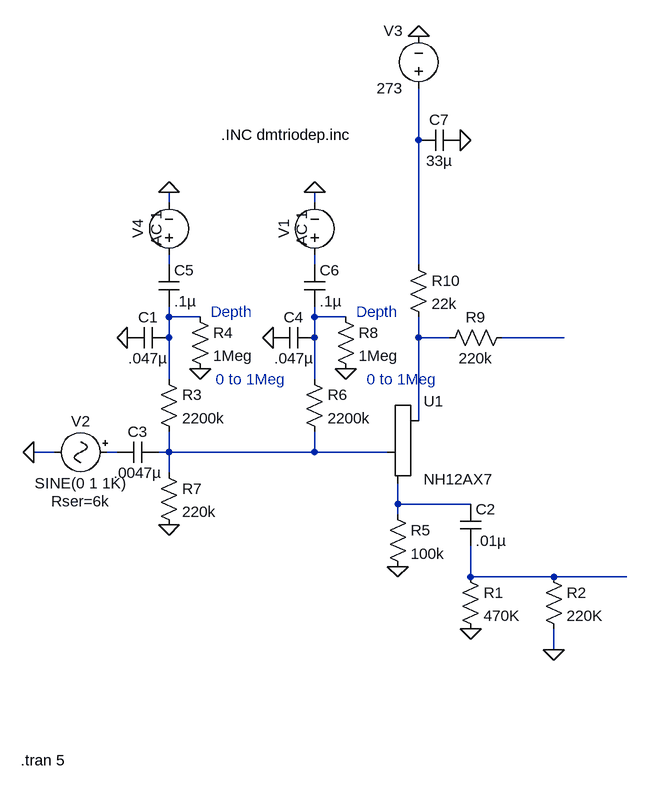
[diagram p0: schematic Simplified Dual Tremolo.asc]
Simplified Dual Tremolo.asc, the LTspice schematic file:
Version 4
SHEET 1 880 680
WIRE -16 -448 -16 -528
WIRE -400 -352 -400 -368
WIRE -176 -352 -176 -368
WIRE -400 -256 -400 -272
WIRE -176 -256 -176 -272
WIRE -16 -256 -16 -448
WIRE -400 -176 -400 -192
WIRE -352 -176 -400 -176
WIRE -176 -176 -176 -192
WIRE -128 -176 -176 -176
WIRE -400 -144 -400 -176
WIRE -176 -144 -176 -176
WIRE -16 -144 -16 -176
WIRE 32 -144 -16 -144
WIRE 208 -144 112 -144
WIRE -400 -80 -400 -144
WIRE -176 -80 -176 -144
WIRE -16 -16 -16 -144
WIRE -576 32 -608 32
WIRE -480 32 -496 32
WIRE -400 32 -400 0
WIRE -400 32 -416 32
WIRE -176 32 -176 0
WIRE -176 32 -400 32
WIRE -64 32 -176 32
WIRE -400 64 -400 32
WIRE -48 112 -48 80
WIRE 64 112 -48 112
WIRE -48 128 -48 112
WIRE 64 224 64 176
WIRE 192 224 64 224
WIRE 304 224 192 224
WIRE 192 336 192 304
FLAG -48 208 0
FLAG 64 304 0
FLAG 192 336 0
FLAG -400 144 0
FLAG -240 -144 0
FLAG -128 -96 0
FLAG -608 32 0
FLAG -16 -608 0
FLAG 48 -448 0
FLAG -176 -368 0
FLAG -464 -144 0
FLAG -352 -96 0
FLAG -400 -368 0
SYMBOL res 48 208 R0
SYMATTR InstName R1
SYMATTR Value 470K
SYMBOL res 176 208 R0
SYMATTR InstName R2
SYMATTR Value 220K
SYMBOL Misc\\triode -16 32 R0
SYMATTR InstName U1
SYMATTR Value NH12AX7
SYMBOL cap 48 112 R0
SYMATTR InstName C2
SYMATTR Value .01µ
SYMBOL res -64 112 R0
SYMATTR InstName R5
SYMATTR Value 100k
SYMBOL cap -416 16 R90
WINDOW 0 0 32 VBottom 0
WINDOW 3 32 32 VTop 0
SYMATTR InstName C3
SYMATTR Value .0047µ
SYMBOL res -192 -96 R0
SYMATTR InstName R6
SYMATTR Value 2200k
SYMBOL res -416 48 R0
SYMATTR InstName R7
SYMATTR Value 220k
SYMBOL cap -176 -160 R90
WINDOW 0 0 32 VBottom 0
WINDOW 3 32 32 VTop 0
SYMATTR InstName C4
SYMATTR Value .047µ
SYMBOL res -144 -192 R0
SYMATTR InstName R8
SYMATTR Value 1Meg
SYMBOL Misc\\signal -480 32 R90
WINDOW 0 -32 56 VBottom 0
WINDOW 3 32 56 VTop 0
WINDOW 123 60 56 VTop 0
WINDOW 39 60 56 VTop 0
SYMATTR InstName V2
SYMATTR SpiceLine Rser=6k
SYMBOL voltage -16 -512 R180
WINDOW 0 24 104 Left 0
WINDOW 3 24 16 Left 0
WINDOW 123 0 0 Left 0
WINDOW 39 0 0 Left 0
SYMATTR InstName V3
SYMATTR Value 273
SYMBOL res 128 -160 R90
WINDOW 0 0 56 VBottom 0
WINDOW 3 32 56 VTop 0
SYMATTR InstName R9
SYMATTR Value 220k
SYMBOL cap -192 -256 R0
SYMATTR InstName C6
SYMATTR Value .1µ
SYMBOL res -32 -272 R0
SYMATTR InstName R10
SYMATTR Value 22k
SYMBOL cap 48 -464 R90
WINDOW 0 0 32 VBottom 0
WINDOW 3 32 32 VTop 0
SYMATTR InstName C7
SYMATTR Value 33µ
SYMBOL voltage -176 -256 R180
WINDOW 0 32 56 VTop 0
WINDOW 3 -32 56 Invisible 0
WINDOW 123 4 56 VTop 0
WINDOW 39 0 0 Left 0
SYMATTR InstName V1
SYMATTR Value SINE(137 115 1.33)
SYMATTR Value2 AC 1
SYMBOL res -416 -96 R0
SYMATTR InstName R3
SYMATTR Value 2200k
SYMBOL cap -400 -160 R90
WINDOW 0 0 32 VBottom 0
WINDOW 3 32 32 VTop 0
SYMATTR InstName C1
SYMATTR Value .047µ
SYMBOL res -368 -192 R0
SYMATTR InstName R4
SYMATTR Value 1Meg
SYMBOL cap -416 -256 R0
SYMATTR InstName C5
SYMATTR Value .1µ
SYMBOL voltage -400 -256 R180
WINDOW 0 32 56 VTop 0
WINDOW 3 -32 56 Invisible 0
WINDOW 123 4 56 VTop 0
WINDOW 39 0 0 Left 0
SYMATTR InstName V4
SYMATTR Value SINE(137 115 1)
SYMATTR Value2 AC 1
TEXT -112 -184 Left 0 ;Depth
TEXT -96 -80 Left 0 ;0 to 1Meg
TEXT -320 -456 Left 0 !.INC dmtriodep.inc
TEXT -336 -184 Left 0 ;Depth
TEXT -328 -80 Left 0 ;0 to 1Meg
TEXT -628 506 Left 0 !.tran 5

The netlist it stands for:
* Simplified Dual Tremolo.asc
R1 N011 0 470K
R2 N011 0 220K
XU1 N006 N009 N010 NH12AX7
C2 N010 N011 .01µ
R5 N010 0 100k
C3 N009 N008 .0047µ
R6 N005 N009 2200k
R7 N009 0 220k
C4 N005 0 .047µ
R8 N005 0 1Meg
V2 N008 0 SINE(0 1 1K) Rser=6k
V3 N001 0 273
R9 N007 N006 220k
C6 N003 N005 .1µ
R10 N001 N006 22k
C7 0 N001 33µ
V1 N003 0 SINE(137 115 1.33) AC 1
R3 N004 N009 2200k
C1 N004 0 .047µ
R4 N004 0 1Meg
C5 N002 N004 .1µ
V4 N002 0 SINE(137 115 1) AC 1
* Depth
* 0 to 1Meg
.INC dmtriodep.inc
* Depth
* 0 to 1Meg
.tran 5
.backanno
.end